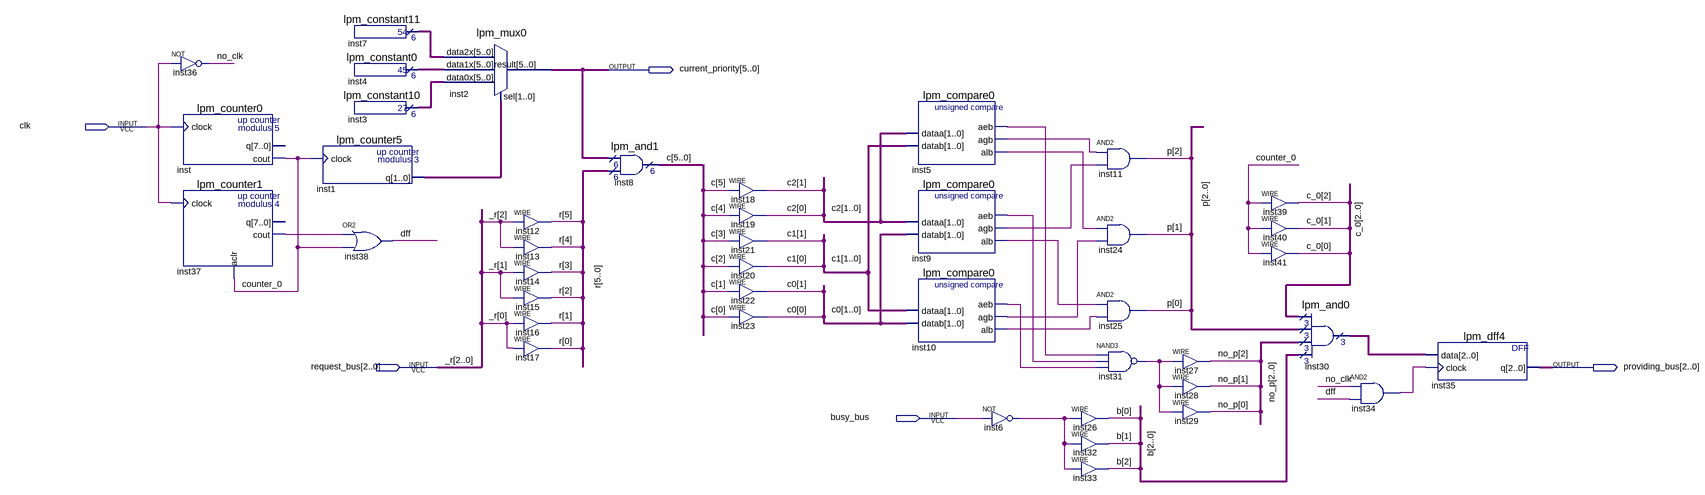
[diagram p0: schematic sheet]
// Quartus schematic arbitrator.bdf as structural Verilog: 42 symbols, 5 pins
module arbitrator (
  input  clk,
  input  [2:0] request_bus,
  input  busy_bus,
  output [5:0] current_priority,
  output [2:0] providing_bus
);

  wire counter_0, dff, inst5_aeb, inst5_agb, inst5_alb, inst6_out, inst9_aeb, inst9_agb, inst9_alb,
       inst10_aeb, inst10_agb, inst10_alb, inst31_out, inst34_out, inst37_cout, no_clk;
  wire [1:0] c0, c1, c2, inst1_q;
  wire [2:0] b, c_0, inst30_result, no_p, p;
  wire [5:0] c, inst3_result, inst4_result, inst7_result, r;

  not inst36 (no_clk, clk);
  lpm_counter0 inst (.clock(clk), .cout(counter_0));  // open: q
  lpm_counter1 inst37 (.clock(clk), .aclr(counter_0), .cout(inst37_cout));  // open: q
  lpm_counter5 inst1 (.clock(counter_0), .q(inst1_q));
  lpm_constant11 inst7 (.result(inst7_result));
  lpm_constant0 inst4 (.result(inst4_result));
  lpm_constant10 inst3 (.result(inst3_result));
  or inst38 (dff, inst37_cout, counter_0);
  lpm_mux0 inst2 (
    .data2x(inst7_result), .data1x(inst4_result), .data0x(inst3_result), .sel(inst1_q),
    .result(current_priority));
  assign r[5] = request_bus[2];  // WIRE inst12
  assign r[4] = request_bus[2];  // WIRE inst13
  assign r[3] = request_bus[1];  // WIRE inst14
  assign r[2] = request_bus[1];  // WIRE inst15
  assign r[1] = request_bus[0];  // WIRE inst16
  assign r[0] = request_bus[0];  // WIRE inst17
  lpm_and1 inst8 (.data0x(current_priority), .data1x(r), .result(c));
  assign c2[1] = c[5];  // WIRE inst18
  assign c2[0] = c[4];  // WIRE inst19
  assign c1[1] = c[3];  // WIRE inst21
  assign c1[0] = c[2];  // WIRE inst20
  assign c0[1] = c[1];  // WIRE inst22
  assign c0[0] = c[0];  // WIRE inst23
  lpm_compare0 inst5 (.dataa(c2), .datab(c1), .aeb(inst5_aeb), .agb(inst5_agb), .alb(inst5_alb));
  lpm_compare0 inst9 (.dataa(c2), .datab(c0), .aeb(inst9_aeb), .agb(inst9_agb), .alb(inst9_alb));
  lpm_compare0 inst10 (.dataa(c1), .datab(c0), .aeb(inst10_aeb), .agb(inst10_agb), .alb(inst10_alb));
  not inst6 (inst6_out, busy_bus);
  assign b[0] = inst6_out;  // WIRE inst26
  assign b[1] = inst6_out;  // WIRE inst32
  assign b[2] = inst6_out;  // WIRE inst33
  and inst11 (p[2], inst5_agb, inst9_agb);
  and inst24 (p[1], inst5_alb, inst10_agb);
  and inst25 (p[0], inst9_alb, inst10_alb);
  nand inst31 (inst31_out, inst5_aeb, inst9_aeb, inst10_aeb);
  assign no_p[2] = inst31_out;  // WIRE inst27
  assign no_p[1] = inst31_out;  // WIRE inst28
  assign no_p[0] = inst31_out;  // WIRE inst29
  assign c_0[2] = counter_0;  // WIRE inst39
  assign c_0[1] = counter_0;  // WIRE inst40
  assign c_0[0] = counter_0;  // WIRE inst41
  lpm_and0 inst30 (.data0x(c_0), .data1x(p), .data2x(no_p), .data3x(b), .result(inst30_result));
  and inst34 (inst34_out, no_clk, dff);
  lpm_dff4 inst35 (.data(inst30_result), .clock(inst34_out), .q(providing_bus));

  // Other names for the same wires on the sheet: _r[2:0] = request_bus
endmodule
